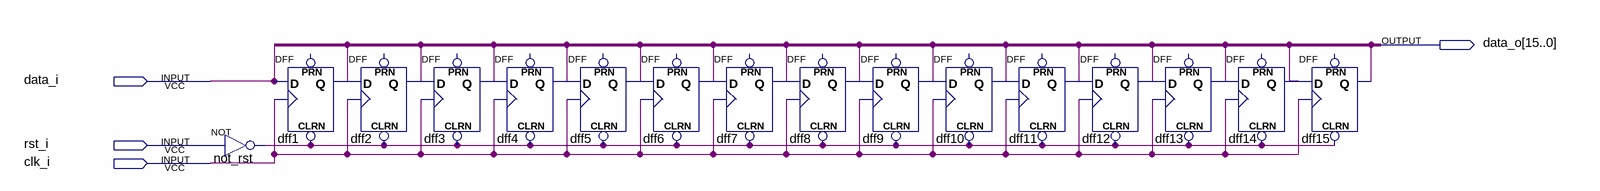
[diagram p0: schematic sheet]
// Quartus schematic queue_15.bdf as structural Verilog: 16 symbols, 4 pins
module queue_15 (
  input  data_i,
  input  rst_i,
  input  clk_i,
  output [15:0] data_o
);

  wire not_rst_out;

  not not_rst (not_rst_out, rst_i);
  DFF dff1 (.CLRN(not_rst_out), .CLK(clk_i), .D(data_i), .Q(data_o[1]));  // open: PRN
  DFF dff2 (.CLRN(not_rst_out), .CLK(clk_i), .D(data_o[1]), .Q(data_o[2]));  // open: PRN
  DFF dff3 (.CLRN(not_rst_out), .CLK(clk_i), .D(data_o[2]), .Q(data_o[3]));  // open: PRN
  DFF dff4 (.CLRN(not_rst_out), .CLK(clk_i), .D(data_o[3]), .Q(data_o[4]));  // open: PRN
  DFF dff5 (.CLRN(not_rst_out), .CLK(clk_i), .D(data_o[4]), .Q(data_o[5]));  // open: PRN
  DFF dff6 (.CLRN(not_rst_out), .CLK(clk_i), .D(data_o[5]), .Q(data_o[6]));  // open: PRN
  DFF dff7 (.CLRN(not_rst_out), .CLK(clk_i), .D(data_o[6]), .Q(data_o[7]));  // open: PRN
  DFF dff8 (.CLRN(not_rst_out), .CLK(clk_i), .D(data_o[7]), .Q(data_o[8]));  // open: PRN
  DFF dff9 (.CLRN(not_rst_out), .CLK(clk_i), .D(data_o[8]), .Q(data_o[9]));  // open: PRN
  DFF dff10 (.CLRN(not_rst_out), .CLK(clk_i), .D(data_o[9]), .Q(data_o[10]));  // open: PRN
  DFF dff11 (.CLRN(not_rst_out), .CLK(clk_i), .D(data_o[10]), .Q(data_o[11]));  // open: PRN
  DFF dff12 (.CLRN(not_rst_out), .CLK(clk_i), .D(data_o[11]), .Q(data_o[12]));  // open: PRN
  DFF dff13 (.CLRN(not_rst_out), .CLK(clk_i), .D(data_o[12]), .Q(data_o[13]));  // open: PRN
  DFF dff14 (.CLRN(not_rst_out), .CLK(clk_i), .D(data_o[13]), .Q(data_o[14]));  // open: PRN
  DFF dff15 (.CLRN(not_rst_out), .CLK(clk_i), .D(data_o[14]), .Q(data_o[15]));  // open: PRN

  assign data_o[0] = data_i;
endmodule
